# EAGLE design TD1-V2 (EAGLE 9.6.2)
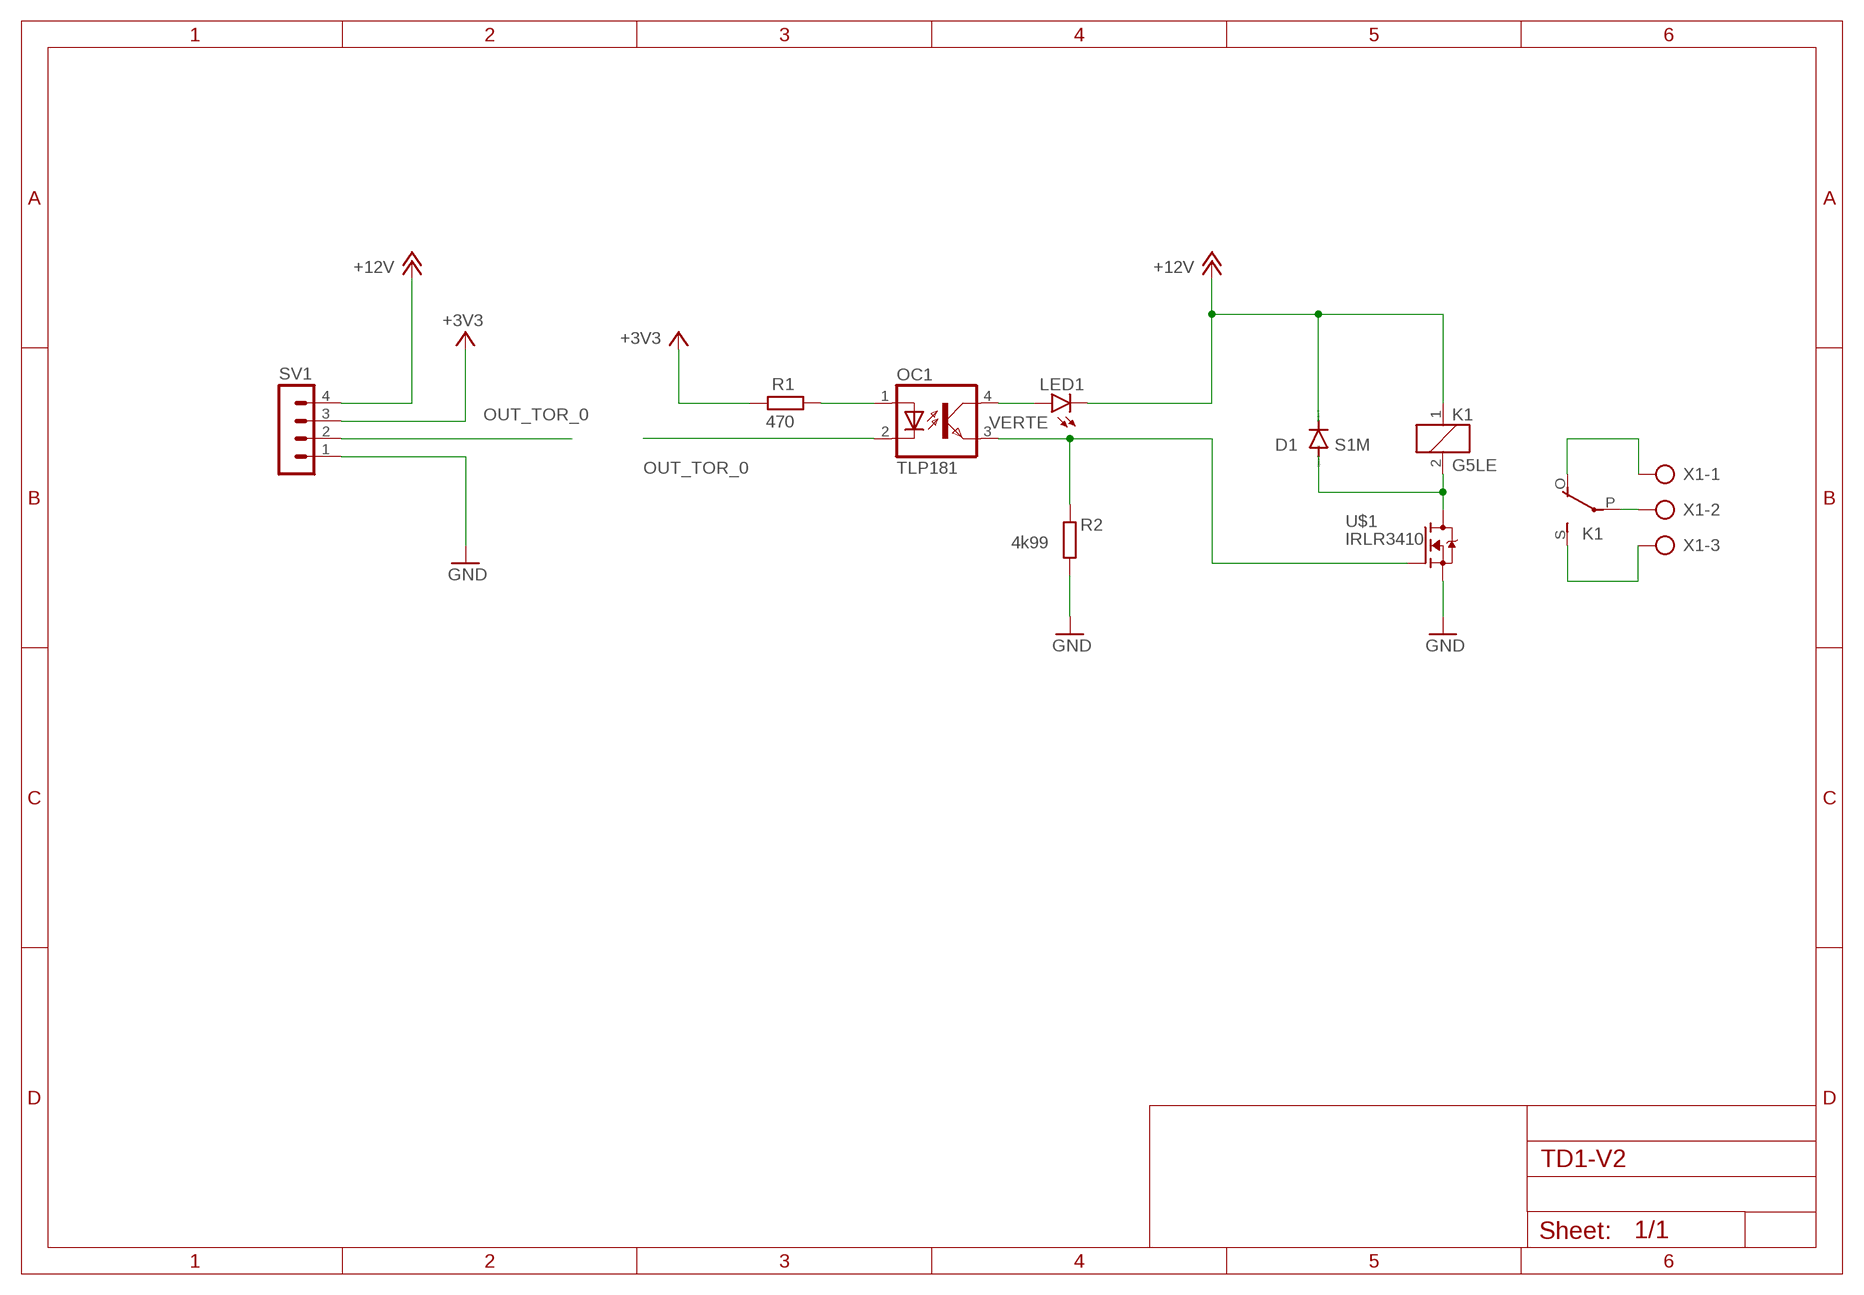
[diagram p0: schematic, sheet 1]

## Parts
D1  S1M  [SMA]
K1  G5LE  [G5LE]
LED1  VERTE  LED5MM  [LED5MM]
OC1  TLP181  [SO-4]
R1  470  R-EU_0204/7  [0204/7]
R2  4k99  R-EU_0204/7  [0204/7]
SV1  MA04-1  [MA04-1]
U$1  IRLR3410  [TO252]
X1  AK300/3  [AK300/3]

## Nets
+3V3: R1.2 SV1.3
+12V: D1.C K1.1 LED1.K(C) SV1.4
GND: R2.2 SV1.1 U$1.3(S)
N$2: OC1.1(A) R1.1
N$3: LED1.A OC1.4(COL)
N$4: OC1.3(EMIT) R2.1 U$1.1(G)
N$6: D1.A K1.2 U$1.4(D)
N$7: K1.P(2:P) X1.2
N$8: K1.O(2:O) X1.1
N$9: K1.S(2:S) X1.3
OUT_TOR_0: OC1.2(C) SV1.2

## Library data of the parts
D1 = diode:S1M
K1 = relay:G5LE: RELAY 1 x switch, 10 A/120 V AC, 8 A/30 V DC, Omron
LED1 = led:LED: LED OSRAM: - CHIPLED LG R971, LG N971, LY N971, LG Q971, LY Q971, LO R971, LY R971 LH N974, LH R974 LS Q976, LO Q976, LY Q976 LO Q996 - Hyper CHIPLED LW Q18S LB Q993, LB Q99A, LB R99A - SideLED LS A670, LO A670, LY A670, LG A670, LP A670 LB A673, LV A673, LT A673, LW A673 LH A674 LY A675 LS A676, LA A676, LO A676, LY A676, LW A676 LS A679, LY A679, LG A679 - Hyper Micro SIDELED® LS Y876, LA Y876, LO Y876, LY Y876 LT Y87S - SmartLED LW L88C, LW L88S LB L89C, LB L89S, LG L890 LS L89K, LO L89K, LY L89K LS L896, LA L896, LO L896, LY L896 - TOPLED LS T670, LO T670, LY T670, LG T670, LP T670 LSG T670, LSP T670, LSY T670, LOP T670, LYG T670 LG T671, LOG T671, LSG T671 LB T673, LV T673, LT T673, LW T673 LH T674 LS T676, LA T676, LO T676, LY T676, LB T676, LH T676, LSB T676, LW T676 LB T67C, LV T67C, LT T67C, LS T67K, LO T67K, LY T67K, LW E67C LS E67B, LA E67B, LO E67B, LY E67B, LB E67C, LV E67C, LT E67C LW T67C LS T679, LY T679, LG T679 LS T770, LO T770, LY T770, LG T770, LP T770 LB T773, LV T773, LT T773, LW T773 LH T774 LS E675, LA E675, LY E675, LS T675 LS T776, LA T776, LO T776, LY T776, LB T776 LHGB T686 LT T68C, LB T68C - Hyper Mini TOPLED® LB M676 - Mini TOPLED Santana® LG M470 LS M47K, LO M47K, LY M47K Source: http://www.osram.convergy.de LUXEON: - LUMILED® LXK2-PW12-R00, LXK2-PW12-S00, LXK2-PW14-U00, LXK2-PW14-V00 LXK2-PM12-R00, LXK2-PM12-S00, LXK2-PM14-U00 LXK2-PE12-Q00, LXK2-PE12-R00, LXK2-PE12-S00, LXK2-PE14-T00, LXK2-PE14-U00 LXK2-PB12-K00, LXK2-PB12-L00, LXK2-PB12-M00, LXK2-PB14-N00, LXK2-PB14-P00, LXK2-PB14-Q00 LXK2-PR12-L00, LXK2-PR12-M00, LXK2-PR14-Q00, LXK2-PR14-R00 LXK2-PD12-Q00, LXK2-PD12-R00, LXK2-PD12-S00 LXK2-PH12-R00, LXK2-PH12-S00 LXK2-PL12-P00, LXK2-PL12-Q00, LXK2-PL12-R00 Source: www.luxeon.com KINGBRIGHT: KA-3528ASYC Source: www.kingbright.com
OC1 = optocoupler-2:TLP181
R1 R2 = rcl:R-EU_: RESISTOR, European symbol; SPICEPREFIX: R
SV1 = con-lstb:MA04-1: PIN HEADER; OC_FARNELL: unknown; OC_NEWARK: unknown
U$1 = IRLR3410:IRLR3410
X1 = con-ptr500:AK300/3: CONNECTOR; OC_FARNELL: unknown; OC_NEWARK: unknown

## Board
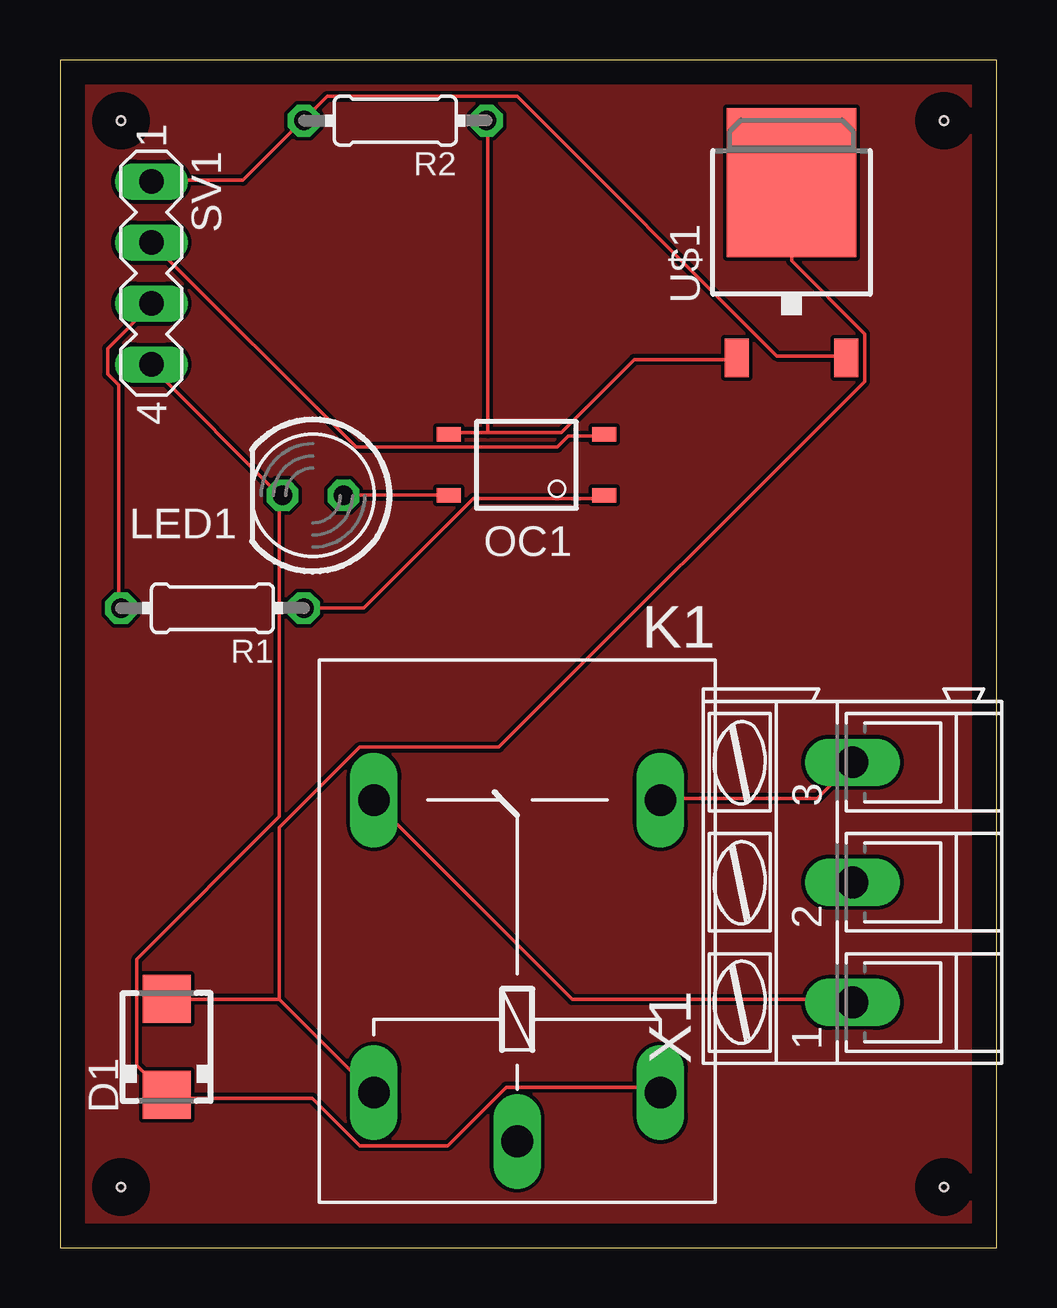
[diagram p1: board, top side]
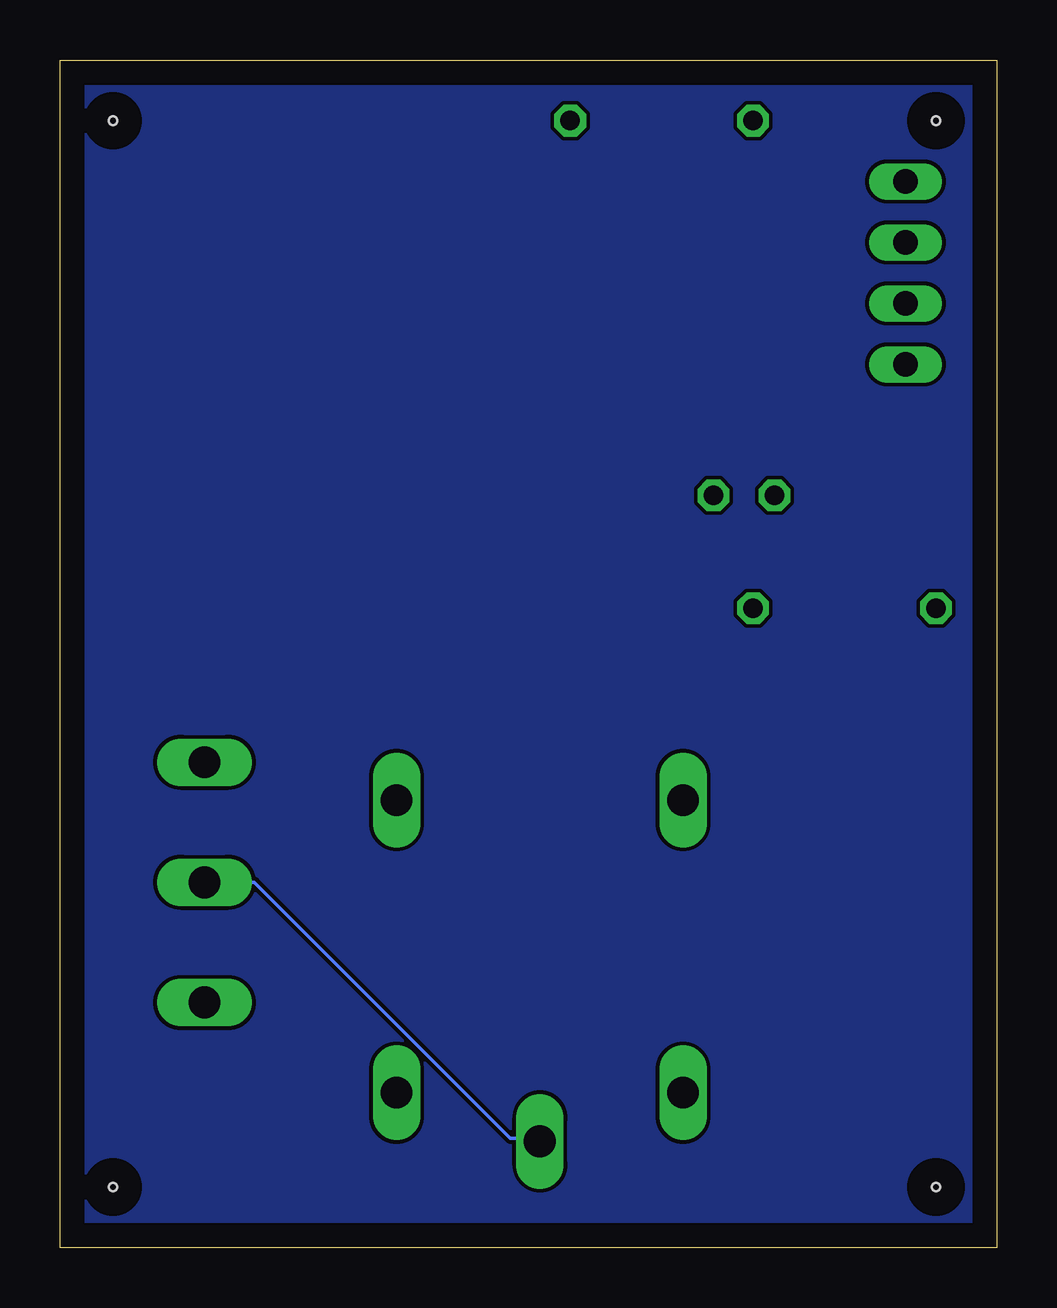
[diagram p2: board, bottom side, seen from below]

Size 39.04 x 49.52 mm. Coordinates in mm from the lower left corner, seen from the top.
Outline: 0,0 39.04,0 39.04,49.52 0,49.52 0,0
Copper layers (1*16): Top 0.035mm / dielectric 1.5mm / Bottom 0.035mm
Design rules "default": minimum track width 6mil, minimum drill 0.35mm, track to track 6mil, track to pad 6mil, pad to pad 6mil, via to via 6mil, smd to smd 6mil, copper to edge 40mil, drill to drill 6mil, minimum pad ring 10mil, minimum via ring 8mil, stop-mask expansion 4mil, vias tented up to drill 0mil, thermal gap 10mil
Holes 0.35 mm at 2.54,46.99 36.83,46.99 36.83,2.54 2.54,2.54

### Footprints (pad centres in the part's own frame; a part is rotated, then mirrored left to right if it is on the bottom)
SMA = smd 2 x 2: A 2,0; C -2,0
G5LE = drill 1.321 long: 1 -7.493,-5.969; 2 -7.493,5.969; O 4.699,5.969; P -9.525,0; S 4.699,-5.969
LED5MM = drill 0.813 octagon: A -1.27,0; K 1.27,0
SO-4 = smd 1 x 0.6: 1 -3.24,0.635; 2 -3.24,-1.905; 3 3.24,-1.905; 4 3.24,0.635
0204/7 = drill 0.813 octagon: 1 -3.81,0; 2 3.81,0
MA04-1 = drill 1.016 long: 1 -3.81,0; 2 -1.27,0; 3 1.27,0; 4 3.81,0
TO252 = smd 1 x 1.6: 1 -2.28,-4.8; 3 2.28,-4.8 | smd 5.4 x 6.2: 4 0,2.5
AK300/3 = drill 1.321 long: 1 -5.004,0; 2 0,0; 3 5.004,0

### Placement (x,y rotation side)
D1  4.45,8.38 90 top
K1  19.05,13.97 90 top
LED1  10.54,31.37 180 top
OC1  19.43,32 180 top
R1  6.35,26.67 180 top
R2  13.97,46.99 180 top
SV1  3.81,40.64 270 top
U$1  30.48,41.91 0 top
X1  33.02,15.24 90 top

### Tracks (layer width: path | path; a pad name or v marks a point on that pad's centre or on a via)
+3V3
  Top 0.152: R1.2 2.44,26.67 2.44,35.97 1.98,36.42 1.98,37.49 3.81,39.32 SV1.3
+12V
  Top 0.152: SV1.4 3.81,36.73 9.14,31.39 LED1.K 9.14,31.24 9.14,17.98 3.2,12.04 3.2,7.62 4.42,6.4 D1.C 4.57,6.25 10.52,6.25 12.5,4.27 16.15,4.27 18.59,6.71 24.84,6.71 24.99,6.55 K1.1
GND
  Top 0.152: U$1.3 32.61,37.19 29.87,37.19 19.05,48.01 11.12,48.01 10.21,47.09 R2.2 10.06,46.94 7.62,44.5 3.81,44.5 SV1.1
N$1
  pour Top: 0,0 0,49.53 39.37,49.53 39.37,0
N$2
  Top 0.152: R1.1 12.65,26.67 17.22,31.24 22.55,31.24 OC1.1
N$3
  Top 0.152: OC1.4 16.15,31.39 11.89,31.39 LED1.A
N$4
  Top 0.152: 17.83,33.98 20.88,33.98 23.93,37.03 28.19,37.03 U$1.1 | 17.83,33.98 16.31,33.98 OC1.3 | 17.83,33.98 17.83,46.94 R2.1
N$5
  pour Bottom: 0,0 0,49.53 38.1,49.53 39.37,49.53 39.37,0
N$6
  Top 0.152: 9.14,10.36 4.57,10.36 D1.A | 9.14,10.36 12.95,6.55 K1.2 | U$1.4 30.48,41.15 33.53,38.1 33.53,36.12 18.29,20.88 12.5,20.88 9.14,17.53 9.14,10.36
N$7
  Bottom 0.152: X1.2 30.94,15.24 20.27,4.57 19.05,4.57 K1.P
N$8
  Top 0.152: X1.1 32.92,10.36 21.34,10.36 13.11,18.59 K1.O
N$9
  Top 0.152: K1.S 25.15,18.75 31.55,18.75 32.92,20.12 X1.3
OUT_TOR_0
  Top 0.152: SV1.2 12.34,33.38 20.73,33.38 21.18,33.83 22.55,33.83 OC1.2